# Altium schematic sheet Sheet2.SchDoc
size A
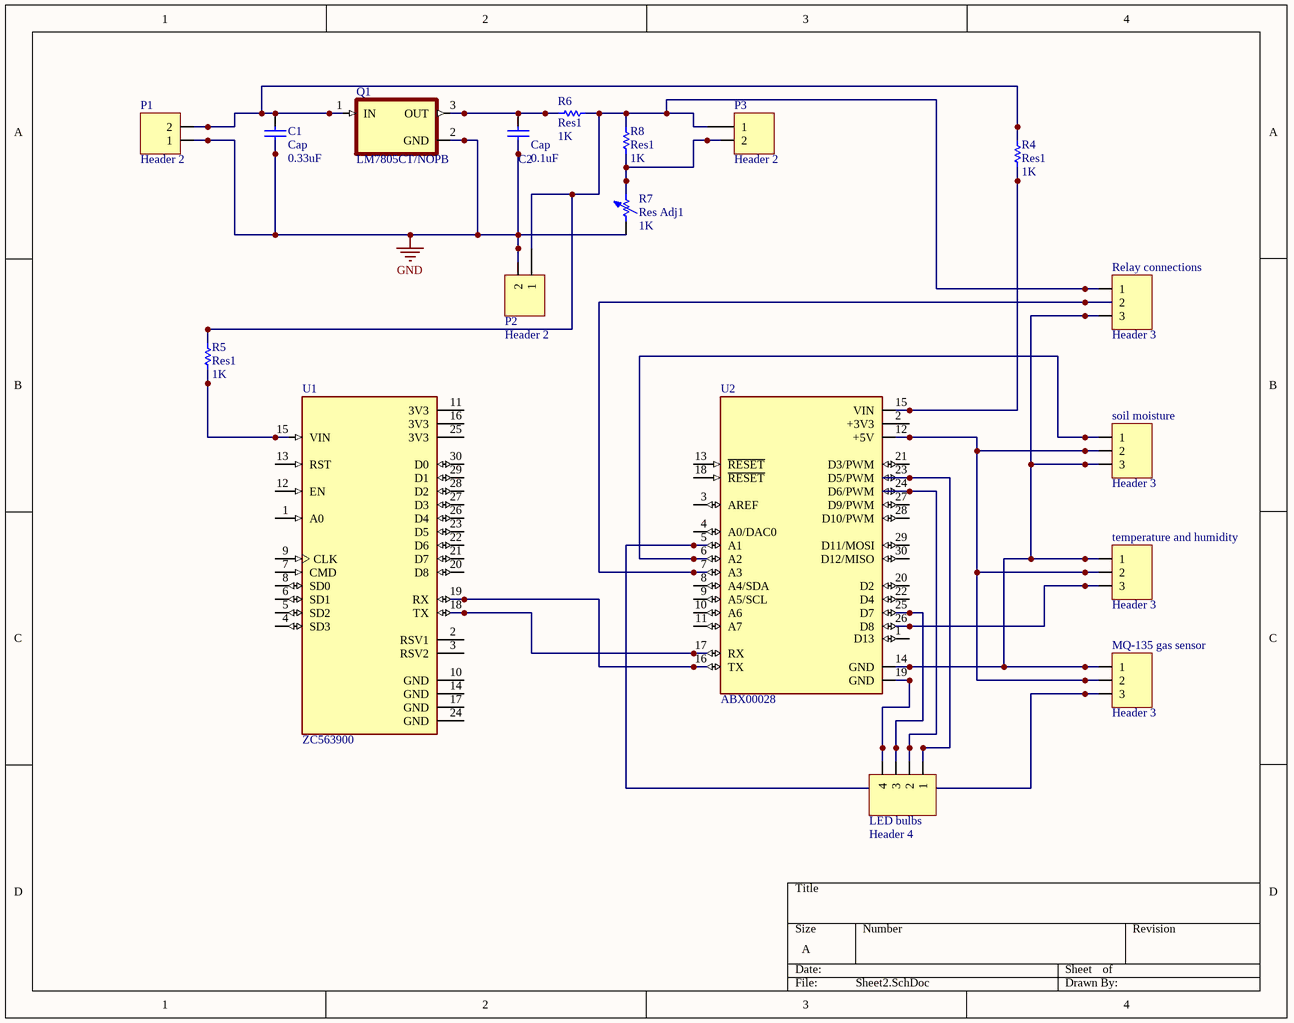
[diagram p0: Sheet2.SchDoc]

## Parts
C1  Cap  value 0.33uF  [RAD-0.3]
C2  Cap  value 0.1uF  [RAD-0.3]
LED_bulbs  Header 4  [HDR1X4]
MQ-135_gas_sensor  Header 3  [HDR1X3]
P1  Header 2  [HDR1X2]
P2  Header 2  [HDR1X2]
P3  Header 2  [HDR1X2]
Q1  LM7805CT/NOPB  [TO254P1054X470X2600-3]
R4  Res1  value 1K  [AXIAL-0.3]
R5  Res1  value 1K  [AXIAL-0.3]
R6  Res1  value 1K  [AXIAL-0.3]
R7  Res Adj1  value 1K  [AXIAL-0.7]
R8  Res1  value 1K  [AXIAL-0.3]
Relay_connections  Header 3  [HDR1X3]
soil_moisture  Header 3  [HDR1X3]
temperature_and_humidity  Header 3  [HDR1X3]
U1  ZC563900  [MODULE_ZC563900]
U2  ABX00028  [MODULE_ABX00028]

## Nets
GND: C1.1 C2.1 P1.1 P2.2 Q1.2(GND) R7.1
NetC1_2: C1.2 P1.2 Q1.1(IN) R4.2
NetC2_2: C2.2 Q1.3(OUT) R6.1
NetLED_bulbs_1: LED_bulbs.1 U2.23(D5/PWM)
NetLED_bulbs_2: LED_bulbs.2 U2.24(D6/PWM)
NetLED_bulbs_3: LED_bulbs.3 U2.25(D7)
NetLED_bulbs_4: LED_bulbs.4 U2.19(GND)
NetMQ-135_gas_sensor_1: MQ-135_gas_sensor.1 Relay_connections.3 soil_moisture.3 temperature_and_humidity.1 U2.14(GND)
NetMQ-135_gas_sensor_2: MQ-135_gas_sensor.2 soil_moisture.2 temperature_and_humidity.2 U2.12(+5V)
NetMQ-135_gas_sensor_3: MQ-135_gas_sensor.3 U2.5(A1)
NetP2_1: P2.1 P3.1 R5.2 R6.2 R8.2 Relay_connections.1
NetP3_2: P3.2 R7.2 R8.1
NetR4_1: R4.1 U2.15(VIN)
NetR5_1: R5.1 U1.15(VIN)
NetRelay_connections_2: Relay_connections.2 U2.7(A3)
Netsoil_moisture_1: soil_moisture.1 U2.6(A2)
Nettemperature_and_humidity_3: temperature_and_humidity.3 U2.26(D8)
NetU1_18: U1.18(TX) U2.17(RX)
NetU1_19: U1.19(RX) U2.16(TX)

Not connected (* = marked no-connect by the designer): U1 1(A0) 2(RSV1) 3(RSV2) 4(SD3) 5(SD2) 6(SD1) 7(CMD) 8(SD0) 9(CLK) 10(GND) 11(3V3) 12(EN) 13(RST) 14(GND) 16(3V3) 17(GND) 20(D8) 21(D7) 22(D6) 23(D5) 24(GND) 25(3V3) 26(D4) 27(D3) 28(D2) 29(D1) 30(D0); U2 1(D13) 2(+3V3) 3(AREF) 4(A0/DAC0) 8(A4/SDA) 9(A5/SCL) 10(A6) 11(A7) 13(~{RESET}) 18(~{RESET}) 20(D2) 21(D3/PWM) 22(D4) 27(D9/PWM) 28(D10/PWM) 29(D11/MOSI) 30(D12/MISO)

## Library data of the parts
C1 C2 = Cap: Capacitor; Published: 8-Jun-2000; LatestRevisionDate: 17-Jul-2002; LatestRevisionNote: Re-released for DXP Platform.; PackageReference: RAD-0.3; Publisher: Altium Limited; PackageDescription: Radial Cap, Thru-Hole; 2 Leads; 0.3 in Pin Spacing
LED_bulbs = Header 4: Header, 4-Pin; LatestRevisionDate: 17-Jul-2002; LatestRevisionNote: Re-released for DXP Platform.; Publisher: Altium Limited
MQ-135_gas_sensor Relay_connections soil_moisture temperature_and_humidity = Header 3: Header, 3-Pin; LatestRevisionDate: 17-Jul-2002; LatestRevisionNote: Re-released for DXP Platform.; Publisher: Altium Limited
P1-P3 = Header 2: Header, 2-Pin; LatestRevisionDate: 17-Jul-2002; LatestRevisionNote: Re-released for DXP Platform.; Publisher: Altium Limited
Q1 = LM7805CT/NOPB: Linear Voltage Regulator IC 1 Output 1A TO-220-3; MF: ON Semiconductor; MP: LM7805CT; SnapEDA_Link: https://www.snapeda.com/parts/LM7805CT/ON%20Semiconductor/view-part/546231/?ref=snap; Price: None; Package: TO-220 ON Semiconductor; Value: *; Availability: Unavailable
R4-R6 R8 = Res1: Resistor; Published: 8-Jun-2000; LatestRevisionDate: 17-Jul-2002; LatestRevisionNote: Re-released for DXP Platform.; PackageReference: AXIAL-0.3; Publisher: Altium Limited; PackageDescription: Axial Device, Thru-Hole; 2 Leads; 0.3 in Pin Spacing
R7 = Res Adj1: Variable Resistor; Set Position: 0.5; Published: 8-Jun-2000; LatestRevisionDate: 17-Jul-2002; LatestRevisionNote: Re-released for DXP Platform.; PackageReference: AXIAL-0.7; Publisher: Altium Limited; PackageDescription: Axial Device, Thru-Hole; 2 Leads; 0.7 in Pin Spacing
U1 = ZC563900: NodeMcu Lua ESP8266 WIFI Internet of Things Network Development Module Board; MF: YKS; MP: ZC563900; Package: None; Price: None; Availability: Unavailable; Value: *; SnapEDA_Link: https://www.snapeda.com/parts/ZC563900/YKS/view-part/607853/?ref=snap
U2 = ABX00028: ATmega4809 Arduino Nano Every AVRÂ® AVR MCU 8-Bit Embedded Evaluation Board; Availability: Warning; Value: *; Package: None; MF: Arduino; Price: None; SnapEDA_Link: https://www.snapeda.com/parts/ABX00028/Arduino/view-part/3656170/?ref=snap; Purchase-URL: https://pricing.snapeda.com/search/part/ABX00028/?ref=eda; Check_prices: https://www.snapeda.com/parts/ABX00028/Arduino/view-part/3656170/?ref=eda; MP: ABX00028